# Altium schematic sheet B100 Block Diagram.SchDoc: B100 Block Diagram
size A4; DocumentNumber: 1; SheetNumber: 1; SheetTotal: 54
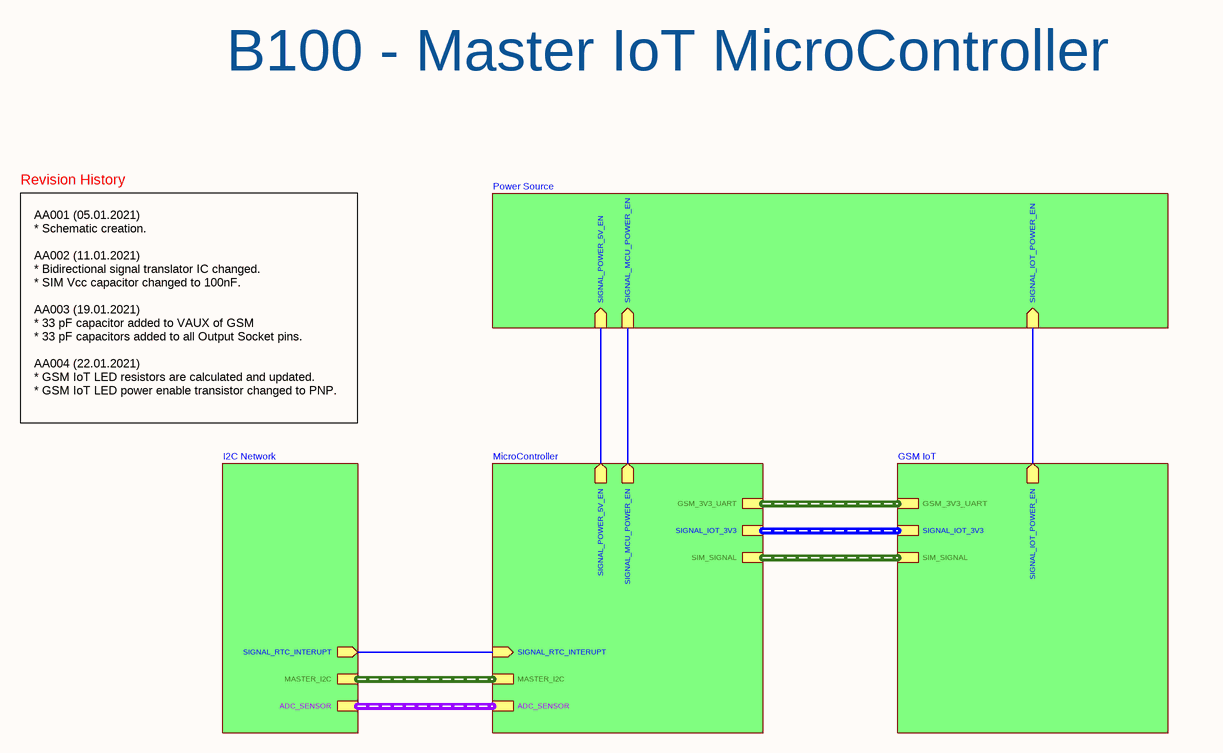
[diagram p0: B100 Block Diagram.SchDoc]

## Sub-sheets
GSM IoT = GSM IoT.SchDoc: GSM_3V3_UART (harness GSM_3V3_UART), SIGNAL_IOT_3V3 (harness SIGNAL_IOT_3V3), SIGNAL_IOT_POWER_EN (out), SIM_SIGNAL (harness SIM_SIGNAL)
I2C Network = I2C Network.SchDoc: MASTER_I2C (harness MASTER_I2C), SIGNAL_RTC_INTERUPT (out), ADC_SENSOR (harness ADC_SENSOR)
MicroController = MicroController.SchDoc: GSM_3V3_UART (harness GSM_3V3_UART), SIGNAL_IOT_3V3 (harness SIGNAL_IOT_3V3), SIM_SIGNAL (harness SIM_SIGNAL), SIGNAL_MCU_POWER_EN (out), SIGNAL_POWER_5V_EN (out), MASTER_I2C (harness MASTER_I2C), SIGNAL_RTC_INTERUPT (in), ADC_SENSOR (harness ADC_SENSOR)
Power Source = Power Source.SchDoc: SIGNAL_MCU_POWER_EN (in), SIGNAL_IOT_POWER_EN (in), SIGNAL_POWER_5V_EN (in)

## Nets
(unnamed): sheet Power Source/SIGNAL_MCU_POWER_EN, sheet MicroController/SIGNAL_MCU_POWER_EN
(unnamed): sheet Power Source/SIGNAL_IOT_POWER_EN, sheet GSM IoT/SIGNAL_IOT_POWER_EN
(unnamed): sheet Power Source/SIGNAL_POWER_5V_EN, sheet MicroController/SIGNAL_POWER_5V_EN
(unnamed): sheet MicroController/SIGNAL_RTC_INTERUPT, sheet I2C Network/SIGNAL_RTC_INTERUPT

## Buses and harness runs
harness sheet GSM IoT/GSM_3V3_UART = sheet MicroController/GSM_3V3_UART
harness sheet GSM IoT/SIGNAL_IOT_3V3 = sheet MicroController/SIGNAL_IOT_3V3
harness sheet GSM IoT/SIM_SIGNAL = sheet MicroController/SIM_SIGNAL
harness sheet I2C Network/ADC_SENSOR = sheet MicroController/ADC_SENSOR
harness sheet I2C Network/MASTER_I2C = sheet MicroController/MASTER_I2C

## Notes on the sheet
- B100 - Master IoT MicroController
- Revision History
- AA001 (05.01.2021)
  * Schematic creation.
  AA002 (11.01.2021)
  * Bidirectional signal translator IC changed.
  * SIM Vcc capacitor changed to 100nF.
  AA003 (19.01.2021)
  * 33 pF capacitor added to VAUX of GSM
  * 33 pF capacitors added to all Output Socket pins.
  AA004 (22.01.2021)
  * GSM IoT LED resistors are calculated and updated.
  * GSM IoT LED power enable transistor changed to PNP.
- Engineer
- All Rights are reserved to Customer and Engineer. [2021]
- Size:
- Date:
- A4
- Project :
- Time:
- Sheet
- of
- Customer
- Product ID
- Module ID
- Version
- File:
- Revision